# EAGLE design microsd_header (EAGLE 7.4.0)
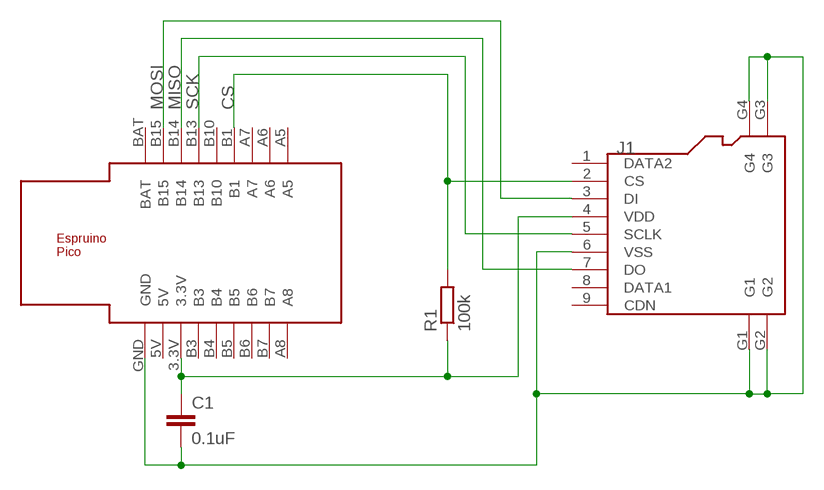
[diagram p0: schematic, sheet 1]

## Parts
C1  0.1uF  C-EUC1206  [C1206]
J1  MICRO-SDCARD-CONNECTOR-3300060P1  [9P-SMD-W/-RING]
R1  100k  R-EU_R1206  [R1206]
U$1  ESPRUINO_PICO_0.1  [ESPRUINO_PICO_0.1]

## Nets
3.3V: C1.1 J1.4(VDD) R1.1 U$1.3.3V
CS: J1.2(CS) R1.2 U$1.B1
GND: C1.2 J1.6(VSS) J1.G1 J1.G2 J1.G3 J1.G4 U$1.GND
MISO: J1.7(DO) U$1.B14
MOSI: J1.3(DI) U$1.B15
SCK: J1.5(SCLK) U$1.B13
Unconnected: J1.1(DATA2) J1.8(DATA1) J1.9(CDN) U$1.5V U$1.A5 U$1.A6 U$1.A7 U$1.A8 U$1.B3 U$1.B4 U$1.B5 U$1.B6 U$1.B7 U$1.B10 U$1.BAT

## Library data of the parts
C1 = rcl:C-EU: CAPACITOR, European symbol
J1 = OPL Eagle Library:MICRO-SDCARD-CONNECTOR
R1 = rcl:R-EU_: RESISTOR, European symbol
U$1 = espruino_pico:ESPRUINO_PICO_0.1

## Net classes
0 default: width 0.305 mm

## Board
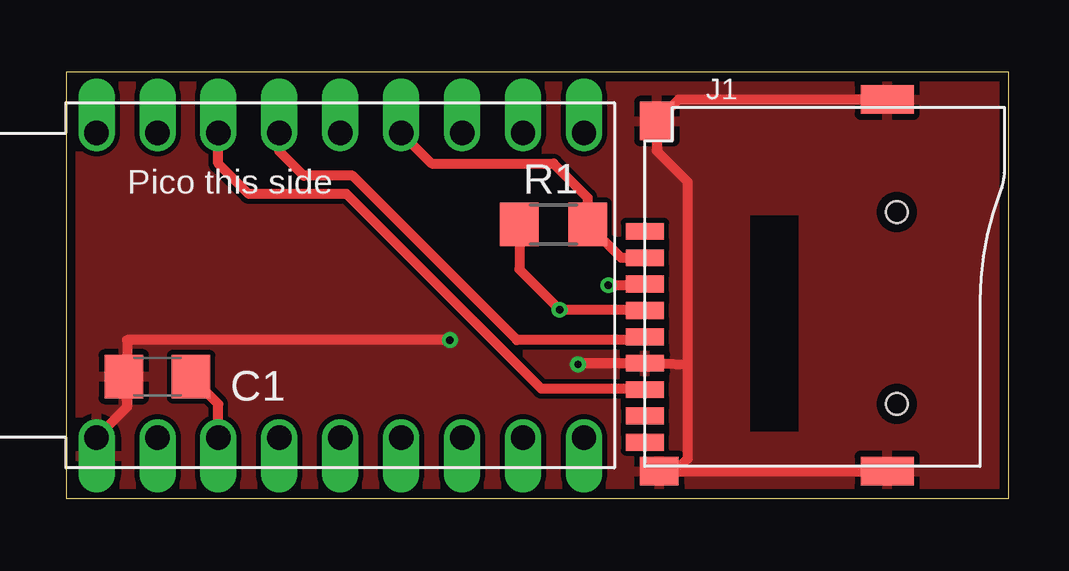
[diagram p1: board, top side]
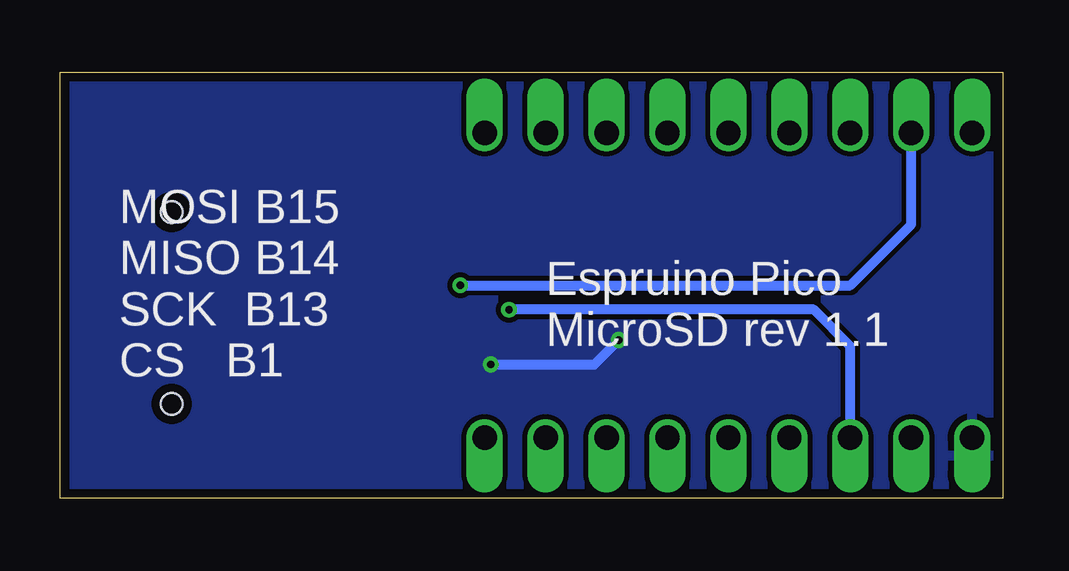
[diagram p2: board, bottom side, seen from below]

Size 39.29 x 17.77 mm. Coordinates in mm from the lower left corner, seen from the top.
Outline: 0,0 39.29,0 39.29,17.77 0,17.77 0,0
Copper layers (1*16): Top 0.0356mm / dielectric 1.5011mm / Bottom 0.0356mm
Design rules "oshpark": minimum track width 10mil, minimum drill 13mil, track to track 8mil, track to pad 6mil, pad to pad 6mil, via to via 6mil, smd to smd 6mil, copper to edge 15mil, drill to drill 6mil, minimum pad ring 7mil, minimum via ring 7mil, stop-mask expansion 4mil, vias tented up to drill 15mil, thermal gap 10mil

### Footprints (pad centres in the part's own frame; a part is rotated, then mirrored left to right if it is on the bottom)
C1206 = smd 1.6 x 1.8: 1 -1.4,0; 2 1.4,0
9P-SMD-W/-RING = smd 1.6 x 0.7: 1 0,2.25; 2 0,1.15; 3 0,0.05; 4 0,-1.05; 5 0,-2.15; 6 0,-3.25; 7 0,-4.35; 8 0,-5.45; 9 0,-6.55 | smd 1.6 x 1.2: G1 0.6,-7.75 | smd 2.2 x 1.2: G2 10.1,-7.75; G3 10.1,7.75 | smd 1.4 x 1.6: G4 0.5,6.85 | hole 0.9: 10.5,-4.95; 10.5,3.05
R1206 = smd 1.6 x 1.803: 1 -1.422,0; 2 1.422,0
ESPRUINO_PICO_0.1 = drill 1.016 offset: 3.3V -7.62,-6.35; 5V -10.16,-6.35; A5 7.62,6.35; A6 5.08,6.35; A7 2.54,6.35; A8 7.62,-6.35; B1 0,6.35; B3 -5.08,-6.35; B4 -2.54,-6.35; B5 0,-6.35; B6 2.54,-6.35; B7 5.08,-6.35; B10 -2.54,6.35; B13 -5.08,6.35; B14 -7.62,6.35; B15 -10.16,6.35; BAT -12.7,6.35; GND -12.7,-6.35

### Placement (x,y rotation side)
C1  3.81,5.08 180 top
J1  24.13,8.89 0 top
R1  20.32,11.43 0 top
U$1  13.97,8.89 0 top

### Tracks (layer width: path | path; a pad name or v marks a point on that pad's centre or on a via)
3.3V  (via drill 0.3)
  Top 0.406: J1.4 24.1,7.87 v20.57,7.87 18.9,9.55 R1.1 | U$1.3.3V 6.35,3.94 C1.1
  Bottom 0.406: U$1.3.3V 6.35,6.35 7.87,7.87 v20.57,7.87
CS
  Top 0.406: J1.2 23.13,10.04 R1.2 21.74,12.55 20.32,13.97 15.24,13.97 U$1.B1
GND  (via drill 0.3)
  Top 0.406: v21.34,5.59 21.34,5.64 J1.6 24.84,5.64 25.91,5.59 | v16,6.6 2.54,6.6 2.54,3.81 | 2.54,3.81 U$1.GND | J1.G3 25.53,16.64 J1.G4 24.63,14.49 25.91,13.21 25.91,5.59 | J1.G1 25.4,1.14 | 25.4,1.14 J1.G2 | 25.91,5.59 25.91,1.65 25.4,1.14 | C1.2 2.41,5.21 2.54,3.81
  Bottom 0.406: v21.34,5.59 17.02,5.59 v16,6.6
  pour Bottom: 0,17.78 39.37,17.78 39.37,0 0,0
  pour Top: 0,17.78 39.37,17.78 39.37,0 0,0
MISO
  Top 0.406: J1.7 24.1,4.57 19.81,4.57 11.68,12.7 7.62,12.7 6.35,13.97 U$1.B14
MOSI  (via drill 0.3)
  Top 0.406: J1.3 24.08,8.89 v22.61,8.89
  Bottom 0.406: v22.61,8.89 6.35,8.89 3.81,11.43 U$1.B15
SCK
  Top 0.406: J1.5 23.99,6.6 18.8,6.6 11.94,13.46 9.91,13.46 8.89,14.48 U$1.B13

### Text on the board
tNames: Pico this side
bNames: Espruino Pico / MicroSD rev 1.1 | MOSI B15 / MISO B14 / SCK B13 / CS B1